# EAGLE design Mux_Board (EAGLE 8.5.0)
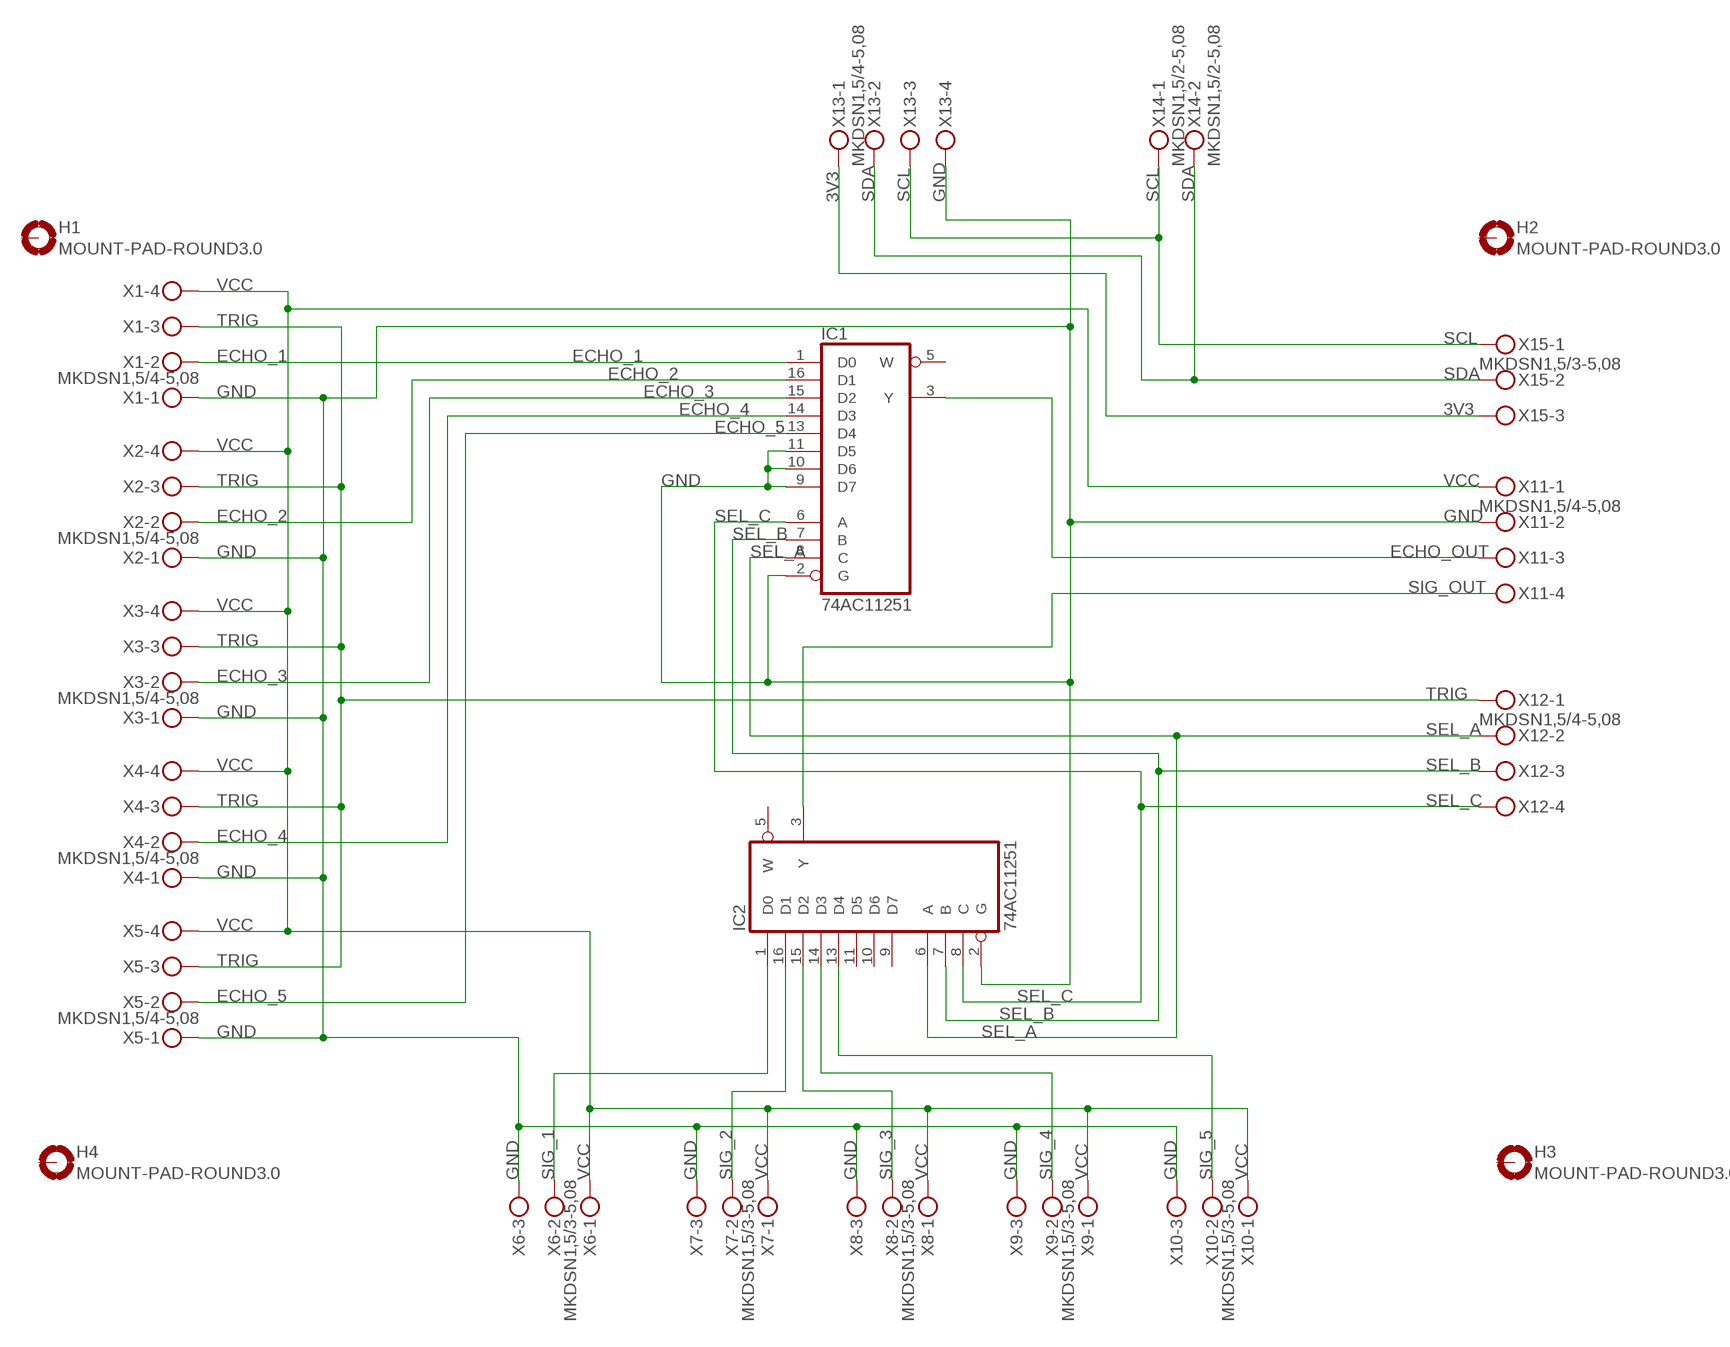
[diagram p0: schematic, sheet 1]

## Parts
H1  MOUNT-PAD-ROUND3.0  [3,0-PAD]
H2  MOUNT-PAD-ROUND3.0  [3,0-PAD]
H3  MOUNT-PAD-ROUND3.0  [3,0-PAD]
H4  MOUNT-PAD-ROUND3.0  [3,0-PAD]
IC1  74AC11251  [DIL16]
IC2  74AC11251  [DIL16]
X1  MKDSN1,5/4-5,08  [MKDSN1,5/4-5,08]
X2  MKDSN1,5/4-5,08  [MKDSN1,5/4-5,08]
X3  MKDSN1,5/4-5,08  [MKDSN1,5/4-5,08]
X4  MKDSN1,5/4-5,08  [MKDSN1,5/4-5,08]
X5  MKDSN1,5/4-5,08  [MKDSN1,5/4-5,08]
X6  MKDSN1,5/3-5,08  [MKDSN1,5/3-5,08]
X7  MKDSN1,5/3-5,08  [MKDSN1,5/3-5,08]
X8  MKDSN1,5/3-5,08  [MKDSN1,5/3-5,08]
X9  MKDSN1,5/3-5,08  [MKDSN1,5/3-5,08]
X10  MKDSN1,5/3-5,08  [MKDSN1,5/3-5,08]
X11  MKDSN1,5/4-5,08  [MKDSN1,5/4-5,08]
X12  MKDSN1,5/4-5,08  [MKDSN1,5/4-5,08]
X13  MKDSN1,5/4-5,08  [MKDSN1,5/4-5,08]
X14  MKDSN1,5/2-5,08  [MKDSN1,5/2-5,08]
X15  MKDSN1,5/3-5,08  [MKDSN1,5/3-5,08]

## Nets
3V3: X13.1 X15.3
ECHO_1: IC1.1(D0) X1.2
ECHO_2: IC1.16(D1) X2.2
ECHO_3: IC1.15(D2) X3.2
ECHO_4: IC1.14(D3) X4.2
ECHO_5: IC1.13(D4) X5.2
ECHO_OUT: IC1.3(Y) X11.3
GND: IC1.2(G) IC1.9(D7) IC1.10(D6) IC1.11(D5) IC2.2(G) X1.1 X2.1 X3.1 X4.1 X5.1 X6.3 X7.3 X8.3 X9.3 X10.3 X11.2 X13.4
SCL: X13.3 X14.1 X15.1
SDA: X13.2 X14.2 X15.2
SEL_A: IC1.8(C) IC2.6(A) X12.2
SEL_B: IC1.7(B) IC2.7(B) X12.3
SEL_C: IC1.6(A) IC2.8(C) X12.4
SIG_1: IC2.1(D0) X6.2
SIG_2: IC2.16(D1) X7.2
SIG_3: IC2.15(D2) X8.2
SIG_4: IC2.14(D3) X9.2
SIG_5: IC2.13(D4) X10.2
SIG_OUT: IC2.3(Y)
TRIG: X1.3 X2.3 X3.3 X4.3 X5.3 X12.1
VCC: X1.4 X2.4 X3.4 X4.4 X5.4 X6.1 X7.1 X8.1 X9.1 X10.1 X11.1
Unconnected: H1.B3,0(MOUNT) H2.B3,0(MOUNT) H3.B3,0(MOUNT) H4.B3,0(MOUNT) IC1.5(W) IC2.5(W) IC2.9(D7) IC2.10(D6) IC2.11(D5) X11.4

## Power pins joined to a net without a drawn wire
GND: IC1.4(GND) IC2.4(GND)
VCC: IC1.12(VCC) IC2.12(VCC)

## Library data of the parts
H1-H4 = holes:MOUNT-PAD-ROUND: MOUNTING PAD, round
IC1 IC2 = 74ac-logic:74AC11251: 1 of 8 DATA SELECTOR/MULTIPLEXER, 3-state
X1-X5 X11-X13 = con-phoenix-508:MKDSN1,5/4-5,08: MKDSN 1,5/ 4-5,08 Printklemme Nennstrom: 13,5 A Nennspannung: 250 V Rastermaß: 5,08 mm Polzahl: 4 Anschlussart: Schraubanschluss Montage: Löten Anschlussrichtung Leiter/Platine: 0 ° Artikelnummer: 1729144 Source: http://eshop.phoenixcontact.com .. 1729144.pdf
X6-X10 X15 = con-phoenix-508:MKDSN1,5/3-5,08: MKDSN 1,5/ 3-5,08 Printklemme Nennstrom: 13,5 A Nennspannung: 250 V Rastermaß: 5,08 mm Polzahl: 3 Anschlussart: Schraubanschluss Montage: Löten Anschlussrichtung Leiter/Platine: 0 ° Artikelnummer: 1729131 Source: http://eshop.phoenixcontact.com .. 1729131.pdf
X14 = con-phoenix-508:MKDSN1,5/2-5,08: MKDSN 1,5/ 2-5,08 Printklemme Nennstrom: 13,5 A Nennspannung: 250 V Rastermaß: 5,08 mm Polzahl: 2 Anschlussart: Schraubanschluss Montage: Löten Anschlussrichtung Leiter/Platine: 0 ° Artikelnummer: 1729128 Source: http://eshop.phoenixcontact.com .. 1729128.pdf

## Board
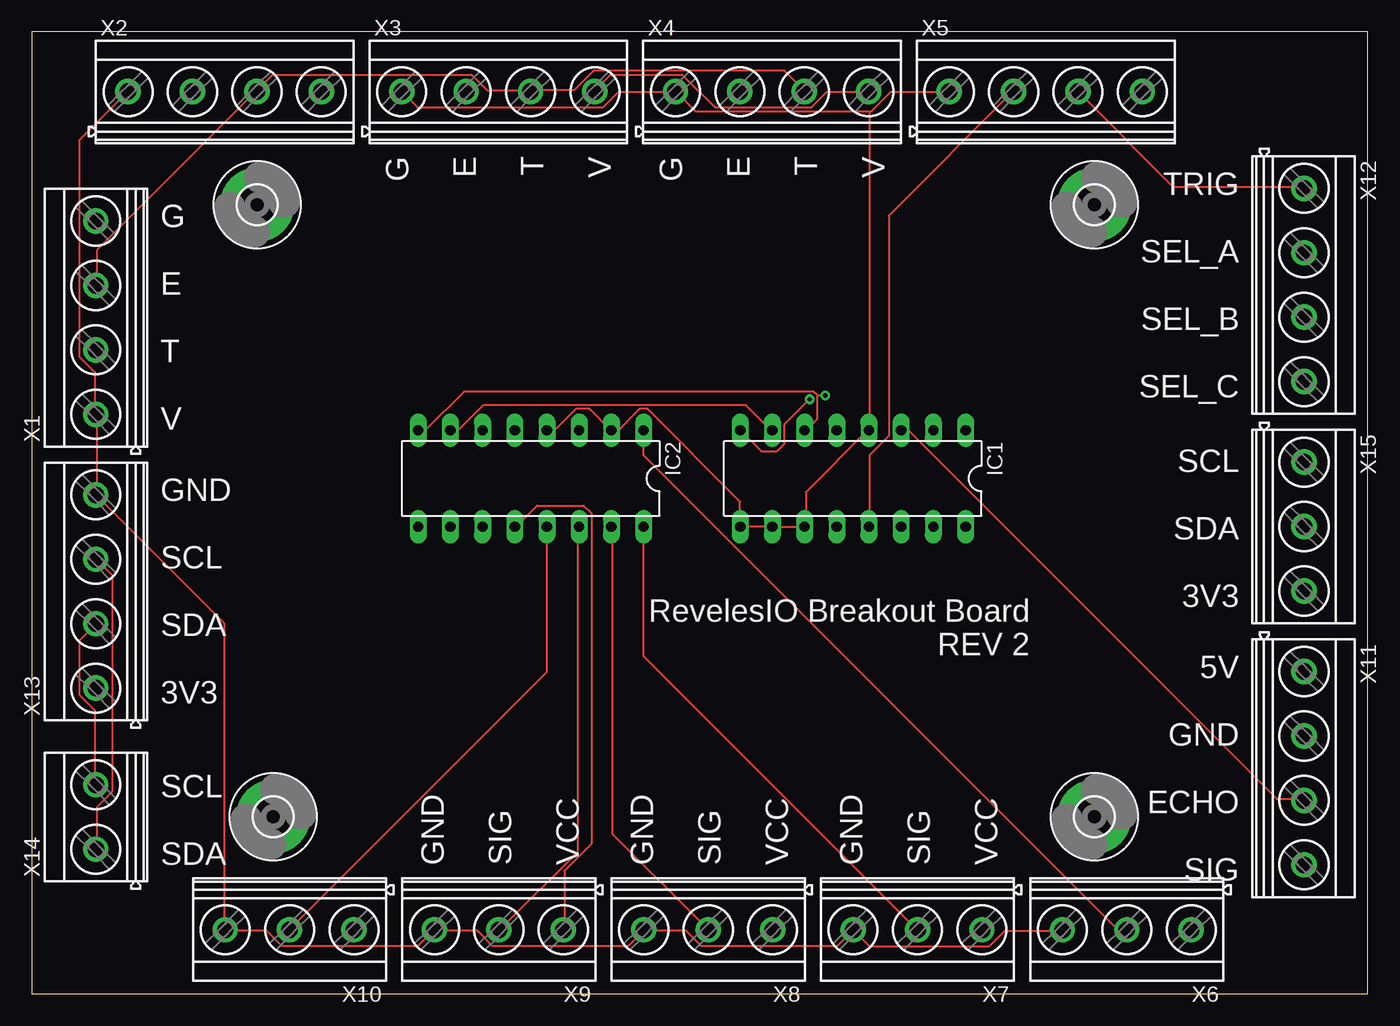
[diagram p1: board, top side]
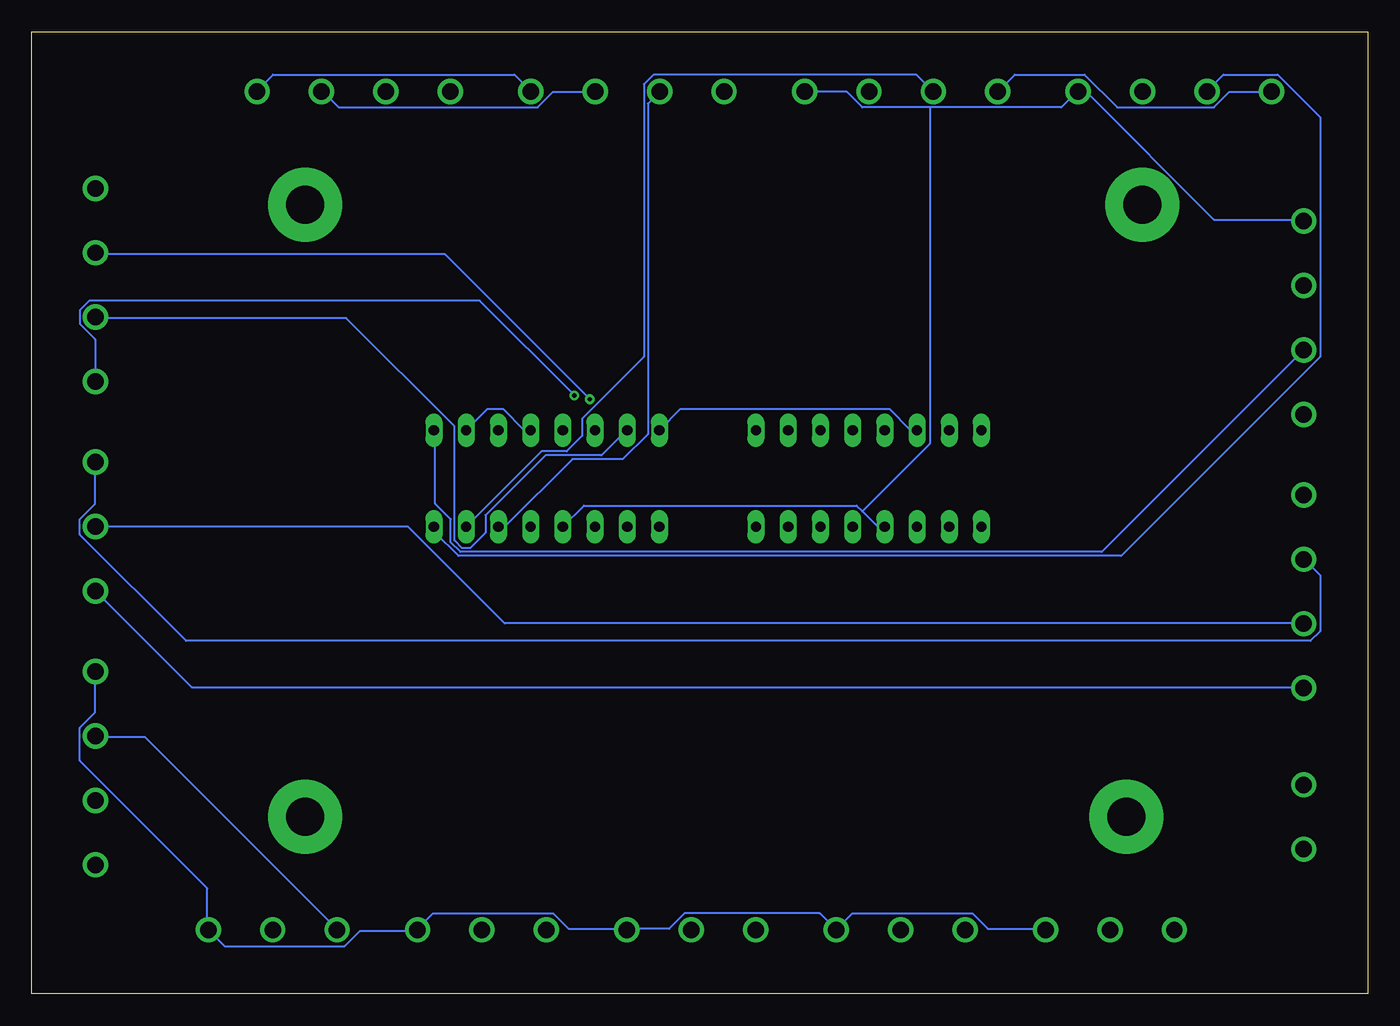
[diagram p2: board, bottom side, seen from below]

Size 105.39 x 75.87 mm. Coordinates in mm from the lower left corner, seen from the top.
Outline: 0,0 105.39,0 105.39,75.87 0,75.87 0,0
Copper layers (1*16): Top 0.035mm / dielectric 1.5mm / Bottom 0.035mm
Design rules "default": minimum track width 6mil, minimum drill 0.35mm, track to track 6mil, track to pad 6mil, pad to pad 6mil, via to via 6mil, smd to smd 6mil, copper to edge 40mil, drill to drill 6mil, minimum pad ring 10mil, minimum via ring 8mil, stop-mask expansion 4mil, vias tented up to drill 0mil, thermal gap 10mil

### Footprints (pad centres in the part's own frame; a part is rotated, then mirrored left to right if it is on the bottom)
3,0-PAD = drill 3 pad 5.842: B3,0 0,0
DIL16 = drill 0.813 long: 1 -8.89,-3.81; 2 -6.35,-3.81; 3 -3.81,-3.81; 4 -1.27,-3.81; 5 1.27,-3.81; 6 3.81,-3.81; 7 6.35,-3.81; 8 8.89,-3.81; 9 8.89,3.81; 10 6.35,3.81; 11 3.81,3.81; 12 1.27,3.81; 13 -1.27,3.81; 14 -3.81,3.81; 15 -6.35,3.81; 16 -8.89,3.81
MKDSN1,5/4-5,08 = drill 1.3 pad 2: 1 -7.641,0.025; 2 -2.561,0.025; 3 2.519,0.025; 4 7.599,0.025
MKDSN1,5/3-5,08 = drill 1.3 pad 2: 1 -7.641,0.025; 2 -2.561,0.025; 3 2.519,0.025
MKDSN1,5/2-5,08 = drill 1.3 pad 2: 1 -2.561,0.025; 2 2.519,0.025

### Placement (x,y rotation side)
H1  19.05,13.97 0 top
H2  17.78,62.23 0 top
H3  83.82,62.23 0 top
H4  83.82,13.97 0 top
IC1  64.77,40.64 180 top
IC2  39.37,40.64 180 top
X1  5.08,53.34 90 top
X2  15.24,71.12 0 top
X3  36.83,71.12 0 top
X4  58.42,71.12 0 top
X5  80.01,71.12 0 top
X6  83.82,5.08 180 top
X7  67.31,5.08 180 top
X8  50.8,5.08 180 top
X9  34.29,5.08 180 top
X10  17.78,5.08 180 top
X11  100.33,17.78 270 top
X12  100.33,55.88 270 top
X13  5.08,31.75 90 top
X14  5.08,13.97 90 top
X15  100.33,34.29 270 top

### Tracks (layer width: path | path; a pad name or v marks a point on that pad's centre or on a via)
3V3
  Bottom 0.152: X13.1 5.13,24.18 92.76,24.18 100.23,31.65 X15.3
ECHO_1
  Bottom 0.152: IC1.1 73.56,44.45 73.56,38.66 72.34,37.44 72.34,35.61 71.58,34.85 20.98,34.85 5.13,50.7 X1.2
ECHO_2
  Bottom 0.152: IC1.16 73.56,36.83 73.56,36.37 71.73,34.54 19.46,34.54 3.76,50.24 3.76,69.14 7.11,72.49 11.38,72.49 12.6,71.27 X2.2
ECHO_3
  Bottom 0.152: IC1.15 65.18,42.77 63.2,42.77 61.98,43.99 61.98,45.36 57.1,50.24 57.1,71.73 56.34,72.49 35.61,72.49 34.39,71.27 X3.2
ECHO_4
  Bottom 0.152: IC1.14 68.07,36.83 62.74,42.16 58.78,42.16 56.79,44.15 56.79,70.21 55.88,71.12 X4.2
ECHO_5
  Top 0.152: IC1.13 66.09,36.83 66.09,42.47 67.61,43.99 67.61,61.37 77.37,71.12 X5.2
ECHO_OUT
  Top 0.152: IC1.3 69.14,44.45 98.25,15.34 100.23,15.34 X11.3
GND
  Top 0.152: X6.3 81.18,4.98 76.76,4.98 75.54,3.76 66.09,3.76 64.87,4.98 X7.3 64.72,4.98 63.5,3.76 52.83,3.76 51.61,4.98 48.41,4.98 X8.3 48.26,4.98 47.04,3.76 36.37,3.76 35.15,4.98 31.8,4.98 X9.3 31.65,4.98 30.43,3.76 19.76,3.76 18.54,4.98 15.34,4.98 X10.3 15.19,5.13 15.19,29.21 5.13,39.27 X13.4 5.13,39.42 5.13,45.67 X1.1 4.98,45.82 4.98,49.02 3.76,50.24 3.76,67.31 7.57,71.12 X2.1 | IC2.4 41.25,44.45 42.93,46.13 43.99,46.13 45.67,44.45 IC2.2 46.28,44.45 47.95,46.13 48.56,46.13 55.88,38.81 IC1.9 IC1.10 IC1.11 61.06,36.83 61.06,39.57 65.94,44.45 IC1.4 66.09,44.45 66.09,69.6 | X3.1 29.21,71.12 30.43,69.9 45.06,69.9 46.28,71.12 50.7,71.12 X4.1 50.85,71.12 52.38,69.6 66.09,69.6 | 66.09,69.6 66.24,69.6 67.77,71.12 72.34,71.12 X5.1
  Bottom 0.152: X11.2 100.23,20.22 96.42,20.22 81.33,5.13 X6.3 | IC1.4 66.55,44.45 68.22,46.13 69.44,46.13 IC1.2 | X2.1 7.72,71.12 10.92,71.12 12.14,69.9 19.76,69.9 22.35,72.49 27.84,72.49 29.06,71.27 X3.1
SCL
  Top 0.152: X14.1 5.13,11.53 5.13,14.73 6.35,15.95 6.35,33.02 5.13,34.24 X13.3
  Bottom 0.152: X15.1 100.38,41.86 100.38,38.66 101.6,37.44 101.6,36.22 93.22,27.84 4.52,27.84 3.76,28.6 3.76,33.02 4.98,34.24 X13.3
SDA
  Top 0.152: X14.2 4.98,16.56 4.98,22.35 3.76,23.57 3.76,27.84 4.98,29.06 X13.2
  Bottom 0.152: X15.2 100.23,36.83 75.69,36.83 68.07,29.21 5.13,29.21 X13.2
SEL_A  (via drill 0.35)
  Top 0.152: v61.37,46.89 59.39,44.91 59.39,43.38 58.78,42.77 57.56,42.77 IC1.8
  Bottom 0.152: IC2.6 36.07,44.45 37.74,46.13 54.2,46.13 IC1.8 | v61.37,46.89 72.8,58.32 100.23,58.32 X12.2
SEL_B
  Top 0.152: IC2.7 33.63,44.45 35.61,46.43 56.34,46.43 58.32,44.45 IC1.7
  Bottom 0.152: X12.3 100.23,53.29 80.57,53.29 72.03,44.76 72.03,35.76 71.42,35.15 70.81,35.15 69.6,36.37 69.6,37.74 64.87,42.47 60.45,42.47 58.47,44.45 IC1.7
SEL_C  (via drill 0.35)
  Top 0.152: IC2.8 31.04,44.45 34.09,47.5 61.67,47.5 61.98,47.19 | 61.98,47.19 61.98,45.36 61.06,44.45 IC1.6 | 61.98,47.19 v62.59,47.19
  Bottom 0.152: v62.59,47.19 70.05,54.66 100.84,54.66 101.6,53.9 101.6,52.83 100.38,51.61 100.38,48.41 X12.4
SIG_1
  Top 0.152: IC2.1 48.26,42.47 85.6,5.13 86.36,5.13 X6.2
SIG_2
  Top 0.152: IC2.16 48.26,26.62 69.75,5.13 X7.2
SIG_3
  Top 0.152: IC2.15 45.82,36.83 45.82,12.6 53.29,5.13 X8.2
SIG_4
  Top 0.152: IC2.14 43.08,36.83 43.08,11.23 36.98,5.13 X9.2
SIG_5
  Top 0.152: IC2.13 40.64,25.4 20.37,5.13 X10.2
TRIG
  Top 0.152: X1.3 5.13,55.88 5.13,58.62 17.63,71.12 X2.3 17.78,71.27 19,72.49 34.7,72.49 35.92,71.27 39.27,71.27 X3.3 39.42,71.27 42.77,71.27 44.3,72.8 59.39,72.8 60.91,71.27 X4.3 | X12.1 100.23,63.65 90.02,63.65 82.55,71.12 X5.3
  Bottom 0.152: 39.42,71.27 X3.3 | X4.3 61.06,71.12 64.26,71.12 65.48,69.9 81.18,69.9 82.4,71.12 X5.3
VCC
  Top 0.152: X4.4 65.94,71.12 62.74,71.12 61.52,69.9 53.9,69.9 51.31,72.49 45.67,72.49 44.45,71.27 X3.4 | X9.1 42.01,5.13 42.01,9.7 44.14,11.84 44.14,37.9 43.54,38.51 39.88,38.51 38.2,36.83 IC2.12
  Bottom 0.152: 58.37,5.18 X8.1 | X4.4 66.09,71.27 67.31,72.49 86.36,72.49 87.58,71.27 X5.4 | X10.1 25.55,5.13 29.97,5.13 31.19,6.35 40.64,6.35 41.86,5.13 X9.1 42.01,5.13 43.23,6.35 53.9,6.35 55.12,5.13 58.32,5.13 X8.1 | X11.1 100.38,25.4 100.38,22.2 101.6,20.98 101.6,18.39 91.54,8.33 91.54,5.13 X6.1 91.39,4.98 90.17,3.76 80.72,3.76 79.5,4.98 75.08,4.98 X7.1 74.93,5.13 73.71,6.35 64.26,6.35 63.04,5.13 58.47,5.13 X8.1 | IC2.12 38.66,36.83 39.88,38.05 | 39.88,38.05 40.33,38.51 61.82,38.51 IC1.12 | X1.4 5.13,61.06 12.14,61.06 22.2,71.12 22.81,71.12 X2.4 22.96,71.12 24.18,69.9 34.54,69.9 | 34.54,69.9 39.88,69.9 41.1,71.12 44.3,71.12 X3.4 | 39.88,38.05 34.54,43.38 34.54,69.9

### Text on the board
tPlace: G / / E / / T / / V | G / / E / / T / / V | G / / E / / T / / V | TRIG / / SEL_A / / SEL_B / / SEL_C | SCL / / SDA / / 3V3 | RevelesIO Breakout Board / REV 2 | GND / / SCL / / SDA / / 3V3 | SCL / / SDA | GND / / SIG / / VCC | GND / / SIG / / VCC | GND / / SIG / / VCC | 5V / / GND / / ECHO / / SIG